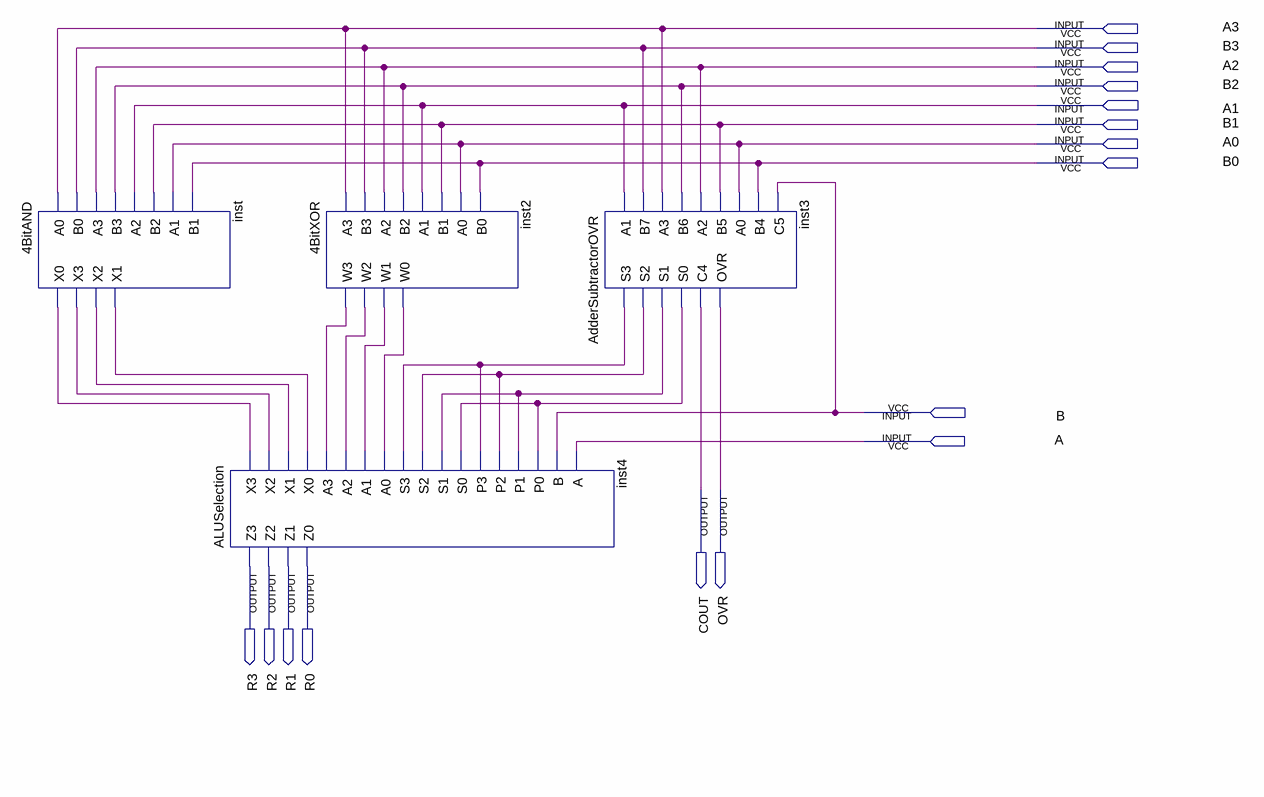
[diagram p0: schematic sheet]
// Quartus schematic ALU.bdf as structural Verilog: 4 symbols, 16 pins
module ALU (
  input  A3,
  input  B3,
  input  A2,
  input  B2,
  input  A1,
  input  B1,
  input  A0,
  input  B0,
  input  B,
  input  A,
  output COUT,
  output OVR,
  output R3,
  output R2,
  output R1,
  output R0
);

  wire inst2_w0, inst2_w1, inst2_w2, inst2_w3, inst3_s0, inst3_s1, inst3_s2, inst3_s3, inst_x0, inst_x1,
       inst_x2, inst_x3;

  \4BitAND  inst (
    .A0(A3), .B0(B3), .A3(A2), .B3(B2), .A2(A1), .B2(B1), .A1(A0), .B1(B0), .X0(inst_x0), .X3(inst_x3),
    .X2(inst_x2), .X1(inst_x1));
  ALUSelection inst4 (
    .X3(inst_x0), .X2(inst_x3), .X1(inst_x2), .X0(inst_x1), .A3(inst2_w3), .A2(inst2_w2), .A1(inst2_w1),
    .A0(inst2_w0), .S3(inst3_s3), .S2(inst3_s2), .S1(inst3_s1), .S0(inst3_s0), .P3(inst3_s3), .P2(inst3_s2),
    .P1(inst3_s1), .P0(inst3_s0), .B(B), .A(A), .Z3(R3), .Z2(R2), .Z1(R1), .Z0(R0));
  \4BitXOR  inst2 (
    .A3(A3), .B3(B3), .A2(A2), .B2(B2), .A1(A1), .B1(B1), .A0(A0), .B0(B0), .W3(inst2_w3), .W2(inst2_w2),
    .W1(inst2_w1), .W0(inst2_w0));
  AdderSubtractorOVR inst3 (
    .A1(A1), .B7(B3), .A3(A3), .B6(B2), .A2(A2), .B5(B1), .A0(A0), .B4(B0), .C5(B), .S3(inst3_s3),
    .S2(inst3_s2), .S1(inst3_s1), .S0(inst3_s0), .C4(COUT), .OVR(OVR));
endmodule
